# EAGLE design Track Me (EAGLE 8.7.0)
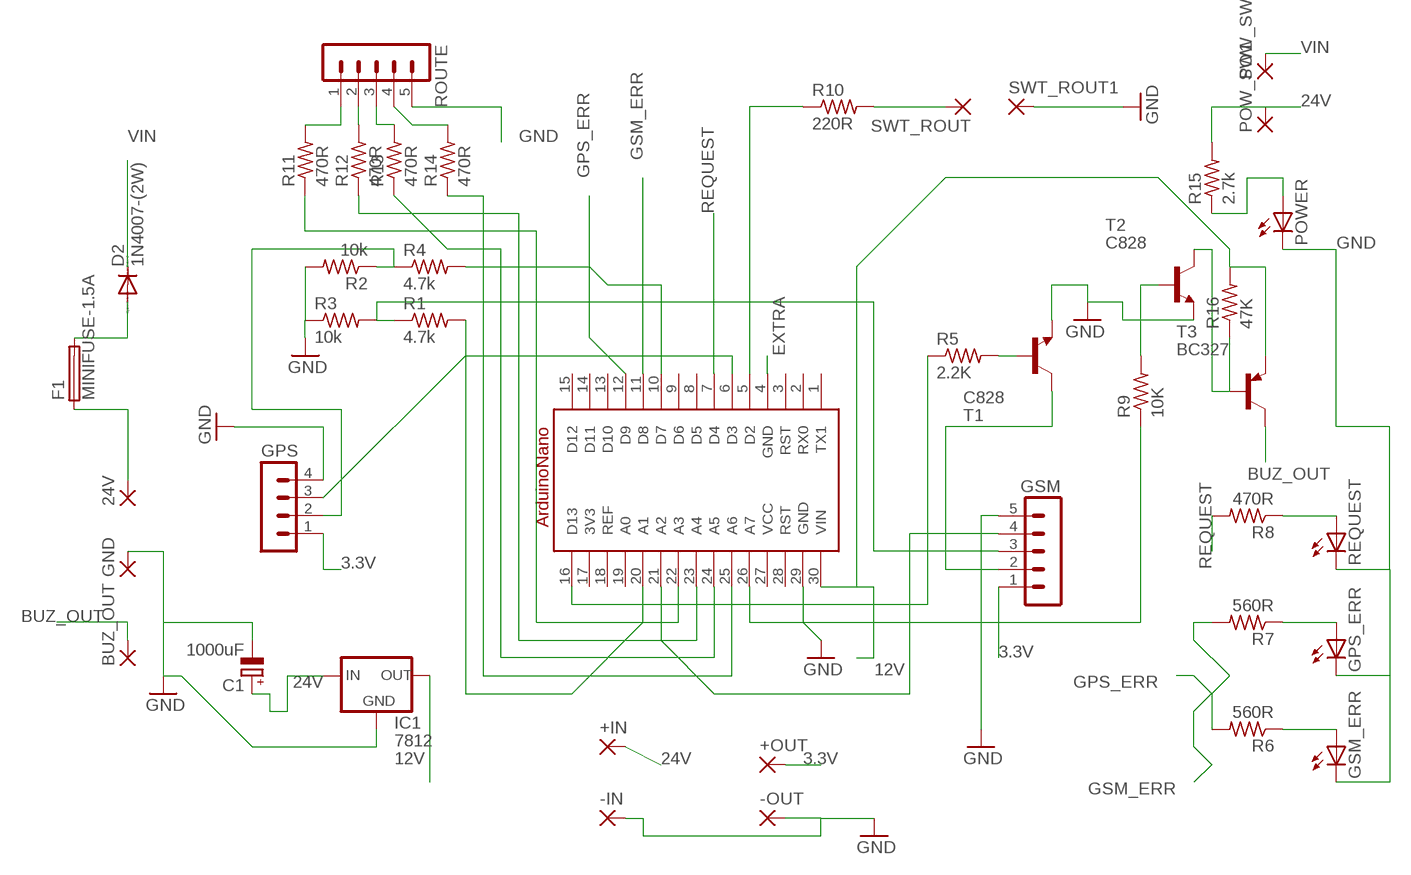
[diagram p0: schematic, sheet 1]

## Parts
24V  2,54/1,1  [2,54/1,1]
+IN  3,17/1,3  [3,17/1,3]
+OUT  3,17/1,3  [3,17/1,3]
-IN  3,17/1,3  [3,17/1,3]
-OUT  3,17/1,3  [3,17/1,3]
A1  ARDUINONANO  [ARDUINONANO]
BUZ_OUT  2,54/1,1  [2,54/1,1]
C1  1000uF  CPOL-EUE5-10.5  [E5-10,5]
D2  1N4007-(2W)  1N4148DO35-7  [DO35-7]
F1  MINIFUSE-1.5A  FUSEPICOFUSE  [PICOFUSE]
GND  2,54/1,1  [2,54/1,1]
GPS  MA04-1  [MA04-1]
GPS_ERR  LED3MM  [LED3MM]
GSM  MA05-1  [MA05-1]
GSM_ERR  LED3MM  [LED3MM]
IC1  7812  78MXXS  [78MXXS]
POW_SW  2,54/1,1  [2,54/1,1]
POW_SW1  2,54/1,1  [2,54/1,1]
POWER  LED3MM  [LED3MM]
R1  4.7k  R-US_0207/7  [0207/7]
R2  10k  R-US_0207/7  [0207/7]
R3  10k  R-US_0207/7  [0207/7]
R4  4.7k  R-US_0207/7  [0207/7]
R5  2.2K  R-US_0207/7  [0207/7]
R6  560R  R-US_0207/7  [0207/7]
R7  560R  R-US_0207/7  [0207/7]
R8  470R  R-US_0207/7  [0207/7]
R9  10K  R-US_0207/7  [0207/7]
R10  220R  R-US_0207/7  [0207/7]
R11  470R  R-US_0207/7  [0207/7]
R12  470R  R-US_0207/7  [0207/7]
R13  470R  R-US_0207/7  [0207/7]
R14  470R  R-US_0207/7  [0207/7]
R15  2.7k  R-US_0207/7  [0207/7]
R16  47K  R-US_0207/7  [0207/7]
REQUEST  LED3MM  [LED3MM]
ROUTE  MA05-1  [MA05-1]
SWT_ROUT  2,54/1,1  [2,54/1,1]
SWT_ROUT1  2,54/1,1  [2,54/1,1]
T1  C828  2SC945  [TO92-ECB]
T2  C828  2SC945  [TO92-ECB]
T3  BC327  BC327-PNP-TO92-EBC  [TO92-EBC]

## Nets
3.3V [POWER]: +OUT.1(P) GPS.1 GSM.1
12V [POWER]: A1.30(VIN) IC1.OUT R16.2 T3.E
24V [POWER]: +IN.1(P) C1.+ IC1.IN POW_SW1.1(P) R15.2
BUZ_OUT: BUZ_OUT.1(P) T3.C
EXTRA: A1.4(GND)
GND [GND]: -IN.1(P) -OUT.1(P) A1.29(GND) C1.- GND.1(P) GPS.4 GPS_ERR.K(C) GSM.5 GSM_ERR.K(C) IC1.GND POWER.K(C) R2.2 R3.1 REQUEST.K(C) ROUTE.5 SWT_ROUT1.1(P) T1.E T2.E
GPS_ERR: A1.12(D9) R6.2
GSM_ERR: A1.11(D8) R7.2
N$1: GPS.2 R2.1 R4.1
N$2: POWER.A R15.1
N$3: GSM.3 R1.1 R3.2
N$4: A1.10(D7) R4.2
N$5: A1.6(D3) GPS.3
N$6 [POWER]: D2.A F1.2
N$7: R11.2 ROUTE.1
N$8: R5.2 T1.B
N$9: A1.16(D13) R5.1
N$10: R10.2 SWT_ROUT.1(P)
N$11: A1.20(A1) R1.2
N$12: A1.21(A2) GSM.4
N$13: R9.2 T2.B
N$14: R8.1 REQUEST.A
N$15: GPS_ERR.A R7.1
N$16 [POWER]: 24V.1(P) F1.1
N$18: GSM.2 T1.C
N$19: A1.5(D2) R10.1
N$20: GSM_ERR.A R6.1
N$21: A1.26(A7) R9.1
N$22: R12.2 ROUTE.2
N$23: R13.2 ROUTE.3
N$24: R14.2 ROUTE.4
N$25: A1.22(A3) R11.1
N$26: A1.23(A4) R12.1
N$27: A1.24(A5) R13.1
N$29: A1.25(A6) R14.1
N$30: R16.1 T2.C T3.B
REQUEST: A1.7(D4) R8.2
VIN [POWER]: D2.C POW_SW.1(P)
Unconnected: A1.1(TX1) A1.2(RX0) A1.3(RST) A1.8(D5) A1.9(D6) A1.13(D10) A1.14(D11) A1.15(D12) A1.19(A0) A1.28(RST)

## Power pins joined to a net without a drawn wire
3V3: A1.17(3V3)
REF: A1.18(REF)
VCC: A1.27(VCC)

## Library data of the parts
24V BUZ_OUT GND POW_SW POW_SW1 SWT_ROUT SWT_ROUT1 = wirepad:2,54/1,1: THROUGH-HOLE PAD
+IN +OUT -IN -OUT = wirepad:3,17/1,3: THROUGH-HOLE PAD
A1 = ArduinoNano:ARDUINONANO
C1 = rcl:CPOL-EU: POLARIZED CAPACITOR, European symbol; SPICEPREFIX: C
D2 = diode:1N4148: DIODE high speed (Philips)
F1 = fuse:FUSE: Fuse; OC_FARNELL: unknown; OC_NEWARK: unknown
GPS = con-lstb:MA04-1: PIN HEADER; OC_FARNELL: unknown; OC_NEWARK: unknown
GPS_ERR GSM_ERR POWER REQUEST = led:LED: LED OSRAM: - CHIPLED LG R971, LG N971, LY N971, LG Q971, LY Q971, LO R971, LY R971 LH N974, LH R974 LS Q976, LO Q976, LY Q976 LO Q996 - Hyper CHIPLED LW Q18S LB Q993, LB Q99A, LB R99A - SideLED LS A670, LO A670, LY A670, LG A670, LP A670 LB A673, LV A673, LT A673, LW A673 LH A674 LY A675 LS A676, LA A676, LO A676, LY A676, LW A676 LS A679, LY A679, LG A679 - Hyper Micro SIDELED® LS Y876, LA Y876, LO Y876, LY Y876 LT Y87S - SmartLED LW L88C, LW L88S LB L89C, LB L89S, LG L890 LS L89K, LO L89K, LY L89K LS L896, LA L896, LO L896, LY L896 - TOPLED LS T670, LO T670, LY T670, LG T670, LP T670 LSG T670, LSP T670, LSY T670, LOP T670, LYG T670 LG T671, LOG T671, LSG T671 LB T673, LV T673, LT T673, LW T673 LH T674 LS T676, LA T676, LO T676, LY T676, LB T676, LH T676, LSB T676, LW T676 LB T67C, LV T67C, LT T67C, LS T67K, LO T67K, LY T67K, LW E67C LS E67B, LA E67B, LO E67B, LY E67B, LB E67C, LV E67C, LT E67C LW T67C LS T679, LY T679, LG T679 LS T770, LO T770, LY T770, LG T770, LP T770 LB T773, LV T773, LT T773, LW T773 LH T774 LS E675, LA E675, LY E675, LS T675 LS T776, LA T776, LO T776, LY T776, LB T776 LHGB T686 LT T68C, LB T68C - Hyper Mini TOPLED® LB M676 - Mini TOPLED Santana® LG M470 LS M47K, LO M47K, LY M47K Source: http://www.osram.convergy.de LUXEON: - LUMILED® LXK2-PW12-R00, LXK2-PW12-S00, LXK2-PW14-U00, LXK2-PW14-V00 LXK2-PM12-R00, LXK2-PM12-S00, LXK2-PM14-U00 LXK2-PE12-Q00, LXK2-PE12-R00, LXK2-PE12-S00, LXK2-PE14-T00, LXK2-PE14-U00 LXK2-PB12-K00, LXK2-PB12-L00, LXK2-PB12-M00, LXK2-PB14-N00, LXK2-PB14-P00, LXK2-PB14-Q00 LXK2-PR12-L00, LXK2-PR12-M00, LXK2-PR14-Q00, LXK2-PR14-R00 LXK2-PD12-Q00, LXK2-PD12-R00, LXK2-PD12-S00 LXK2-PH12-R00, LXK2-PH12-S00 LXK2-PL12-P00, LXK2-PL12-Q00, LXK2-PL12-R00 Source: www.luxeon.com KINGBRIGHT: KA-3528ASYC Source: www.kingbright.com
GSM ROUTE = con-lstb:MA05-1: PIN HEADER; OC_FARNELL: unknown; OC_NEWARK: unknown
IC1 = v-reg:78MXXS: VOLTAGE REGULATOR
R1-R16 = resistor:R-US_: RESISTOR, American symbol
T1 T2 = transistor:2SC945: NPN Silicon Epitaxial Planar Transistor Source: SEMTECH ELECTRONICS LTD. ... 2SC945 2.pdf
T3 = transistor:*-PNP-: PNP Transistror

## Net classes
0 default: width 0.61 mm
1 GND: width 0.762 mm
2 POWER: width 0.889 mm

## Board
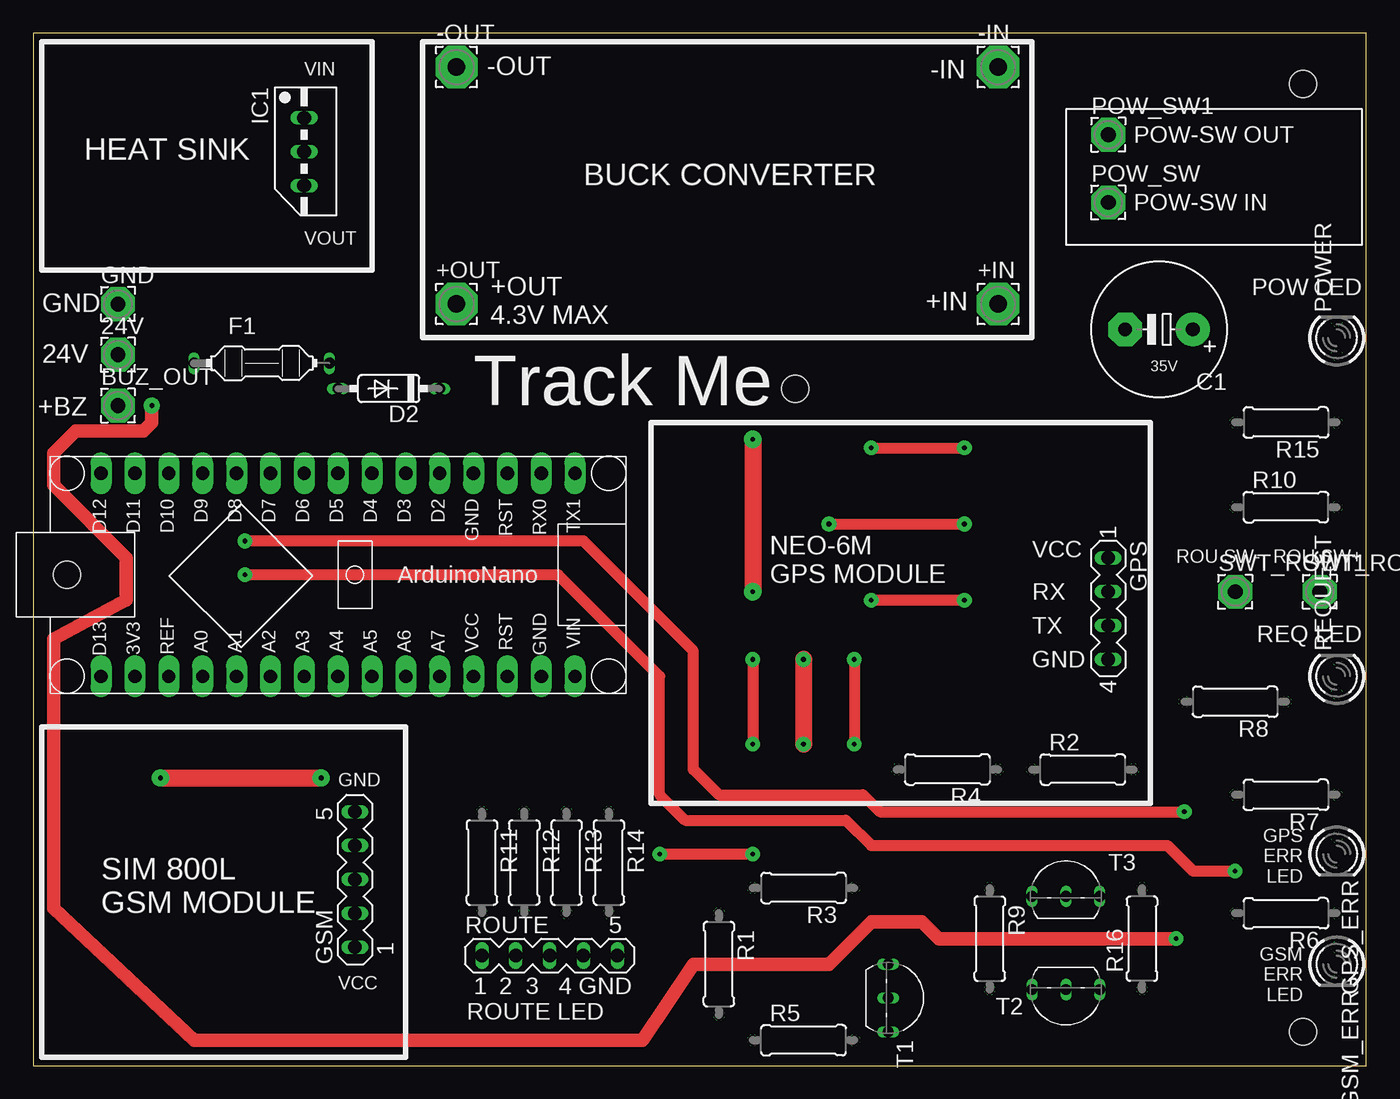
[diagram p1: board, top side]
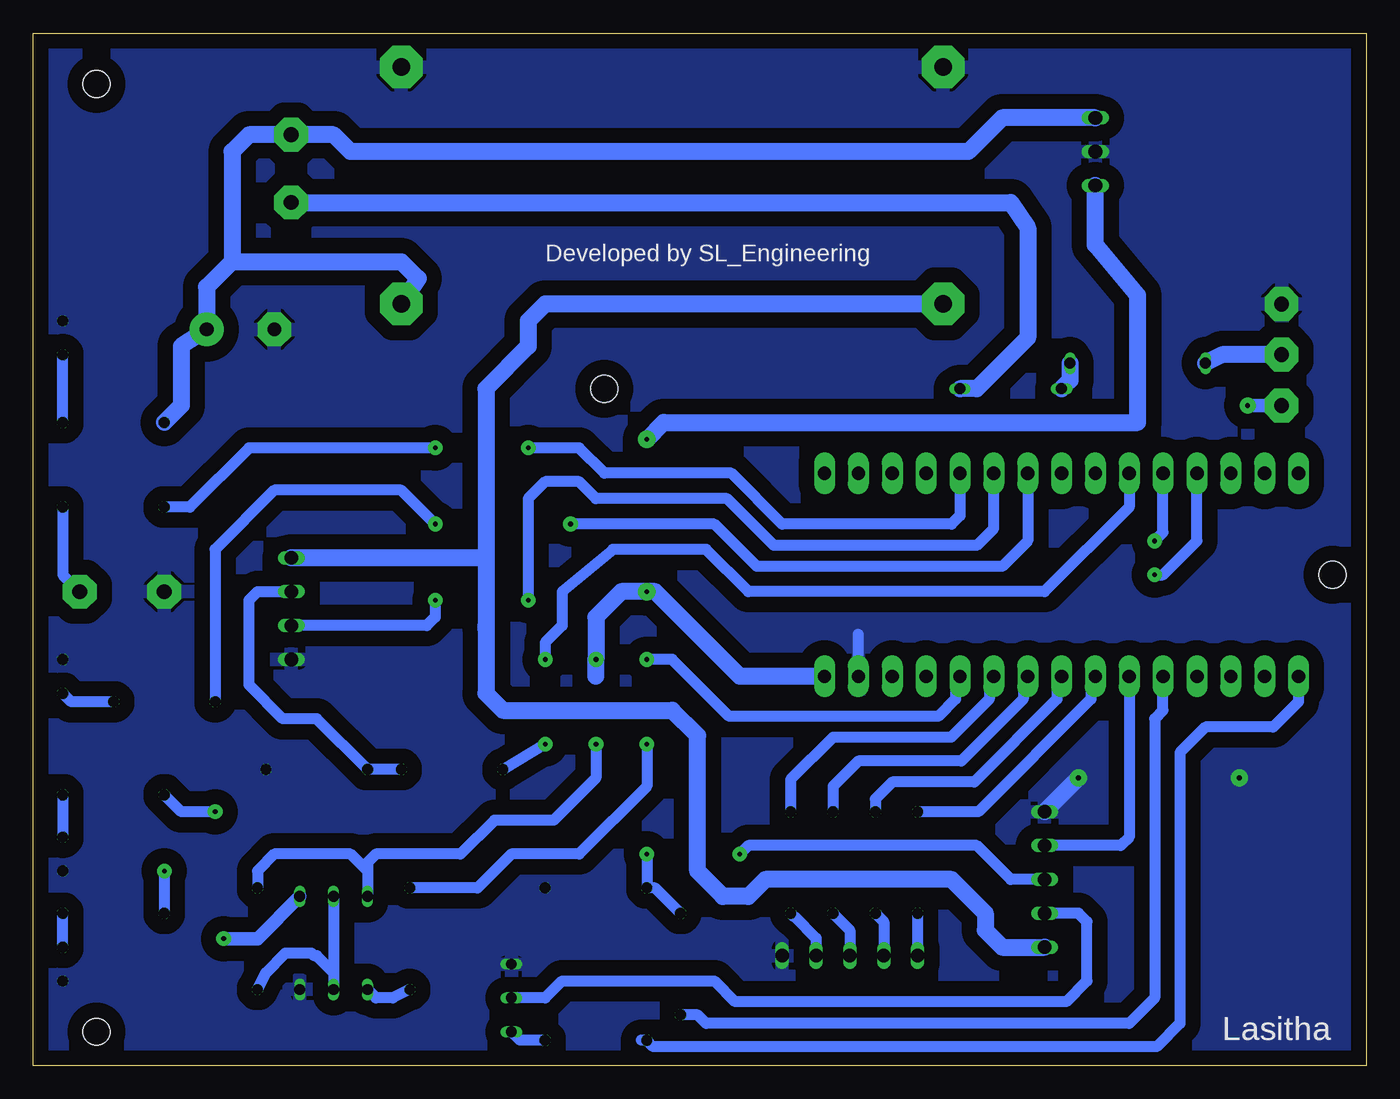
[diagram p2: board, bottom side, seen from below]

Size 100 x 77.46 mm. Coordinates in mm from the lower left corner, seen from the top.
Outline: 0,0 100,0 100,77.46 0,77.46 0,0
Copper layers (1*16): Top 0.035mm / dielectric 1.5mm / Bottom 0.035mm
Design rules "default *": minimum track width 6mil, minimum drill 0.35mm, track to track 30mil, track to pad 40mil, pad to pad 30mil, via to via 6mil, smd to smd 6mil, copper to edge 40mil, drill to drill 6mil, minimum pad ring 0mil, minimum via ring 8mil, stop-mask expansion 4mil, vias tented up to drill 0mil, thermal gap 10mil
Holes 2.03 mm at 95.25,73.66 2.54,36.83 95.25,2.54 57.15,50.8

### Footprints (pad centres in the part's own frame; a part is rotated, then mirrored left to right if it is on the bottom)
2,54/1,1 = drill 1.118 pad 2.54 octagon: 1 0,0
3,17/1,3 = drill 1.321 pad 3.175 octagon: 1 0,0
ARDUINONANO = drill 1 pad 1.575 long: 1 -7.62,16.51; 2 -7.62,13.97; 3 -7.62,11.43; 4 -7.62,8.89; 5 -7.62,6.35; 6 -7.62,3.81; 7 -7.62,1.27; 8 -7.62,-1.27; 9 -7.62,-3.81; 10 -7.62,-6.35; 11 -7.62,-8.89; 12 -7.62,-11.43; 13 -7.62,-13.97; 14 -7.62,-16.51; 15 -7.62,-19.05; 16 7.62,-19.05; 17 7.62,-16.51; 18 7.62,-13.97; 19 7.62,-11.43; 20 7.62,-8.89; 21 7.62,-6.35; 22 7.62,-3.81; 23 7.62,-1.27; 24 7.62,1.27; 25 7.62,3.81; 26 7.62,6.35; 27 7.62,8.89; 28 7.62,11.43; 29 7.62,13.97; 30 7.62,16.51
E5-10,5 = drill 1.016 pad 2.54: + -2.54,0 | drill 1.016 pad 2.54 octagon: - 2.54,0
DO35-7 = drill 0.813 long: A 3.81,0; C -3.81,0
PICOFUSE = drill 0.813 long: 1 -5.08,0; 2 5.08,0
MA04-1 = drill 1.016 long: 1 -3.81,0; 2 -1.27,0; 3 1.27,0; 4 3.81,0
LED3MM = drill 0.813 octagon: A -1.27,0; K 1.27,0
MA05-1 = drill 1.016 long: 1 -5.08,0; 2 -2.54,0; 3 0,0; 4 2.54,0; 5 5.08,0
78MXXS = drill 1.016 long: GND 0,-2.54; IN -2.54,-2.54; OUT 2.54,-2.54
0207/7 = drill 0.813 octagon: 1 -3.81,0; 2 3.81,0
TO92-ECB = drill 0.813 long: B 2.54,0; C 0,0; E -2.54,0
TO92-EBC = drill 0.813 long: B 0,-1.27; C 2.54,-1.27; E -2.54,-1.27

### Placement (x,y rotation side)
24V  6.35,53.34 0 top
+IN  72.39,57.15 0 top
+OUT  31.75,57.15 0 top
-IN  72.39,74.93 0 top
-OUT  31.75,74.93 0 top
A1  24.13,36.83 270 top
BUZ_OUT  6.35,49.53 0 top
C1  84.45,55.24 180 top
D2  26.67,50.8 180 top
F1  17.14,52.7 0 top
GND  6.35,57.15 0 top
GPS  80.64,34.29 270 top
GPS_ERR  97.79,15.88 270 top
GSM  24.13,13.97 90 top
GSM_ERR  97.79,7.62 270 top
IC1  22.86,68.58 270 top
POW_SW  80.64,64.77 0 top
POW_SW1  80.64,69.85 0 top
POWER  97.79,54.61 90 top
R1  51.44,7.62 270 top
R2  78.74,22.23 0 top
R3  57.78,13.34 180 top
R4  68.58,22.23 180 top
R5  57.78,1.91 0 top
R6  93.98,11.43 180 top
R7  93.98,20.32 180 top
R8  90.17,27.3 180 top
R9  71.75,9.53 270 top
R10  93.98,41.91 0 top
R11  33.66,15.24 270 top
R12  36.83,15.24 270 top
R13  40.01,15.24 270 top
R14  43.18,15.24 270 top
R15  93.98,48.26 180 top
R16  83.19,9.53 90 top
REQUEST  97.79,29.21 90 top
ROUTE  38.73,8.26 0 top
SWT_ROUT  96.52,35.56 0 top
SWT_ROUT1  90.17,35.56 0 top
T1  64.14,5.08 270 top
T2  77.47,5.71 180 top
T3  77.47,13.97 0 top

### Tracks (layer width: path | path; a pad name or v marks a point on that pad's centre or on a via)
3.3V
  Bottom 1.27: 66.04,38.1 66.04,50.8 62.87,53.98 62.87,55.88 61.59,57.15 +OUT.1 | 66.04,38.1 66.04,33.01 66,32.88 | 66,32.88 66.04,32.8 | GSM.1 27.3,8.89 28.57,10.16 28.57,11.43 31.11,13.97 45.09,13.97 46.35,12.7 48.26,12.7 50.16,14.61 50.16,24.77 52.07,26.67 64.77,26.67 66.04,27.94 66,27.98 66,32.88 | 66.04,38.1 GPS.1
12V  (via drill 0.35 pad 1.1, 0.35 pad 1.3)
  Top 1.27: v57.78,30.48 v57.78,24.13 | v53.98,46.99 v53.98,35.56
  Bottom 0.813: 74.93,14.61 74.93,15.24 74.3,15.88 67.94,15.88 65.41,18.41 60.96,18.41 57.78,21.59 v57.78,24.13 | 74.93,14.61 T3.E | 74.93,14.61 76.2,15.88 81.92,15.88 83.19,14.61 R16.2
  Bottom 1.27: IC1.OUT 20.32,61.59 17.14,57.78 17.14,48.26 52.7,48.26 v53.98,46.99 | A1.30 46.99,29.21 53.34,35.56 v53.98,35.56 55.88,35.56 57.78,33.66 v57.78,30.48 57.78,29.21
24V
  Bottom 1.27: 85.09,60.33 72.39,60.33 71.12,59.05 +IN.1 | 85.09,60.33 85.09,68.58 83.82,69.85 POW_SW1.1 77.47,69.85 76.2,68.58 29.84,68.58 27.3,71.12 IC1.IN | 85.09,60.33 87,58.42 C1.+ 88.9,53.98 88.9,49.53 R15.2
BUZ_OUT  (via drill 0.35 pad 1.1, 0.35 pad 1.2)
  Top 1.016: v85.72,9.53 67.94,9.53 66.67,10.79 62.87,10.79 59.69,7.62 49.53,7.62 45.72,1.91 12.06,1.91 1.52,11.81 1.52,32 6.99,34.92 6.99,38.1 1.52,43.56 1.52,45.97 3.17,47.62 8.26,47.62 8.89,48.26 v8.89,49.53
  Bottom 1.016: v85.72,9.53 83.19,9.53 T3.C | v8.89,49.53 BUZ_OUT.1
GND  (via drill 0.35 pad 1.3)
  Top 1.27: v9.53,21.59 v21.59,21.59
  Bottom 0.813: A1.29 38.1,32.38
  Bottom 1.27: v21.59,21.59 GSM.5
  pour Bottom (isolate 1.143, rank 2): 0,78.11 0,-0.64 100.97,-0.64 100.97,78.11
GPS_ERR  (via drill 0.35 pad 1.1)
  Top 0.813: v15.88,36.83 39.37,36.83 46.99,29.21 46.99,20.32 48.9,18.41 60.96,18.41 62.87,16.51 85.09,16.51 87,14.61 v90.17,14.61
  Bottom 0.813: v15.88,36.83 15.24,36.83 12.7,39.37 A1.12 | v90.17,14.61 R6.2
GSM_ERR  (via drill 0.35 pad 1.1)
  Top 0.813: v15.88,39.37 41.27,39.37 49.53,31.11 49.53,22.23 51.44,20.32 62.23,20.32 63.5,19.05 v86.36,19.05
  Bottom 0.813: v15.88,39.37 15.24,40.01 A1.11 | v86.36,19.05 88.9,19.05 R7.2
N$1
  Bottom 0.813: R4.1 R2.1 78.74,26.04 81.28,26.04 83.82,28.57 83.82,34.92 83.19,35.56 GPS.2
N$2
  Bottom 0.813: R15.1 POWER.A
N$3  (via drill 0.35 pad 1.1)
  Top 0.813: v46.99,15.88 v53.98,15.88
  Bottom 0.813: GSM.3 26.67,13.97 29.21,16.51 46.35,16.51 v46.99,15.88 | R1.1 53.34,13.34 R3.2 v53.98,15.88
N$4  (via drill 0.35 pad 1.1)
  Top 0.813: v61.59,30.48 v61.59,24.13
  Bottom 0.813: v61.59,24.13 R4.2 | A1.10 17.78,41.91 24.13,35.56 46.35,35.56 49.53,38.73 56.52,38.73 60.33,35.56 60.33,33.02 61.59,31.75 v61.59,30.48
N$5  (via drill 0.35 pad 1.1)
  Top 0.813: v62.87,34.92 v69.85,34.92
  Bottom 0.813: A1.6 27.94,40.31 29.21,39.04 44.44,39.04 47.95,42.55 57.78,42.55 59.05,43.81 61.59,43.81 62.87,42.55 v62.87,34.92 | v69.85,34.92 69.85,33.66 70.48,33.02 GPS.3
N$6
  Bottom 1.27: F1.2 22.23,51.44 D2.A
N$7
  Bottom 0.813: R11.2 ROUTE.1
N$8
  Bottom 0.813: R5.2 63.5,1.91 T1.B
N$9
  Bottom 0.813: A1.16 5.08,27.3 6.99,25.4 12.06,25.4 13.97,23.5 13.97,3.17 15.72,1.42 53.49,1.42 R5.1 54.38,1.91
N$10
  Bottom 0.813: R10.2 97.79,36.83 SWT_ROUT.1
N$11
  Bottom 0.813: A1.20 15.24,26.67 15.88,26.04 15.88,5.08 17.78,3.17 49.53,3.17 50.16,3.81 R1.2
N$12
  Bottom 0.813: A1.21 17.78,17.14 18.41,16.51 GSM.4
N$13
  Bottom 0.813: R9.2 73.03,5.08 74.3,5.08 T2.B
N$14
  Bottom 0.813: R8.1 97.16,27.3 REQUEST.A
N$15
  Bottom 0.813: R7.1 GPS_ERR.A
N$16
  Bottom 1.27: 24V.1 10.79,53.34 F1.1
N$18
  Bottom 0.813: T1.C 61.59,5.08 60.33,6.35 48.9,6.35 47.35,4.8 22.5,4.8 20.95,6.35 20.95,10.79 21.59,11.43 GSM.2
N$19  (via drill 0.35 pad 1.1)
  Top 0.813: v62.87,46.35 v69.85,46.35
  Bottom 0.813: A1.5 30.48,41.27 31.11,40.64 43.81,40.64 47.62,44.45 57.15,44.45 59.05,46.35 v62.87,46.35 | R10.1 88.27,41.91 83.82,46.35 v69.85,46.35
N$20
  Bottom 0.813: GSM_ERR.A R6.1
N$21  (via drill 0.35 pad 1.1)
  Top 0.813: v53.98,30.48 v53.98,24.13
  Bottom 0.813: A1.26 30.81,28.88 30.81,27.51 32.1,26.21 47.8,26.21 52.07,30.48 v53.98,30.48 | R9.1 66.67,13.34 64.14,15.88 59.05,15.88 53.98,20.95 v53.98,24.13
N$22
  Bottom 0.813: R12.2 36.2,10.79 ROUTE.2
N$23
  Bottom 0.813: R13.2 38.73,10.16 ROUTE.3
N$24
  Bottom 0.813: R14.2 42.95,11.2 42.91,11.2 41.27,9.57 ROUTE.4
N$25
  Bottom 0.813: A1.22 20.65,28.88 20.65,27.51 29.11,19.05 R11.1
N$26
  Bottom 0.813: R12.1 36.83,20.02 35.56,21.29 29.41,21.29 23.19,27.51 23.19,28.88 A1.23
N$27
  Bottom 0.813: A1.24 25.73,28.88 25.73,27.51 30.38,22.86 38.1,22.86 40.01,20.95 R13.1
N$29
  Bottom 0.813: A1.25 28.27,28.88 28.27,27.51 31.14,24.64 40.01,24.64 43.18,21.46 R14.1
N$30
  Bottom 0.813: 77.47,6.99 T2.C | T3.B 77.47,6.99 | R16.1 82.55,6.99 81.08,8.46 79.15,8.46 78.94,8.26 78.74,8.26 77.47,6.99
REQUEST  (via drill 0.35 pad 1.1)
  Top 0.813: v59.69,40.64 v69.85,40.64
  Bottom 0.813: R8.2 86.36,38.73 81.92,43.18 72.39,43.18 v69.85,40.64 | A1.7 25.4,39.37 27.3,37.47 45.72,37.47 48.9,40.64 v59.69,40.64
VIN
  Bottom 1.27: POW_SW.1 26.67,64.77 25.4,62.87 25.4,54.61 29.21,50.8 D2.C

### Text on the board
tPlace: VIN | -OUT | -IN | POW-SW OUT | HEAT SINK | BUCK CONVERTER | POW-SW IN | VOUT | +OUT / 4.3V MAX | POW LED | GND | +IN | 24V | 35V | +BZ | Track Me | ROU SW- | ROU SW+ | VCC | NEO-6M / GPS MODULE | RX | REQ LED | TX | GND | GND | GPS / ERR / LED | SIM 800L / GSM MODULE | GSM / ERR / LED | VCC | 2 3 4 GND / ROUTE LED
bPlace: Developed by SL_Engineering | Lasitha